# EAGLE design LightWand_KosmonautED (EAGLE 6.4)
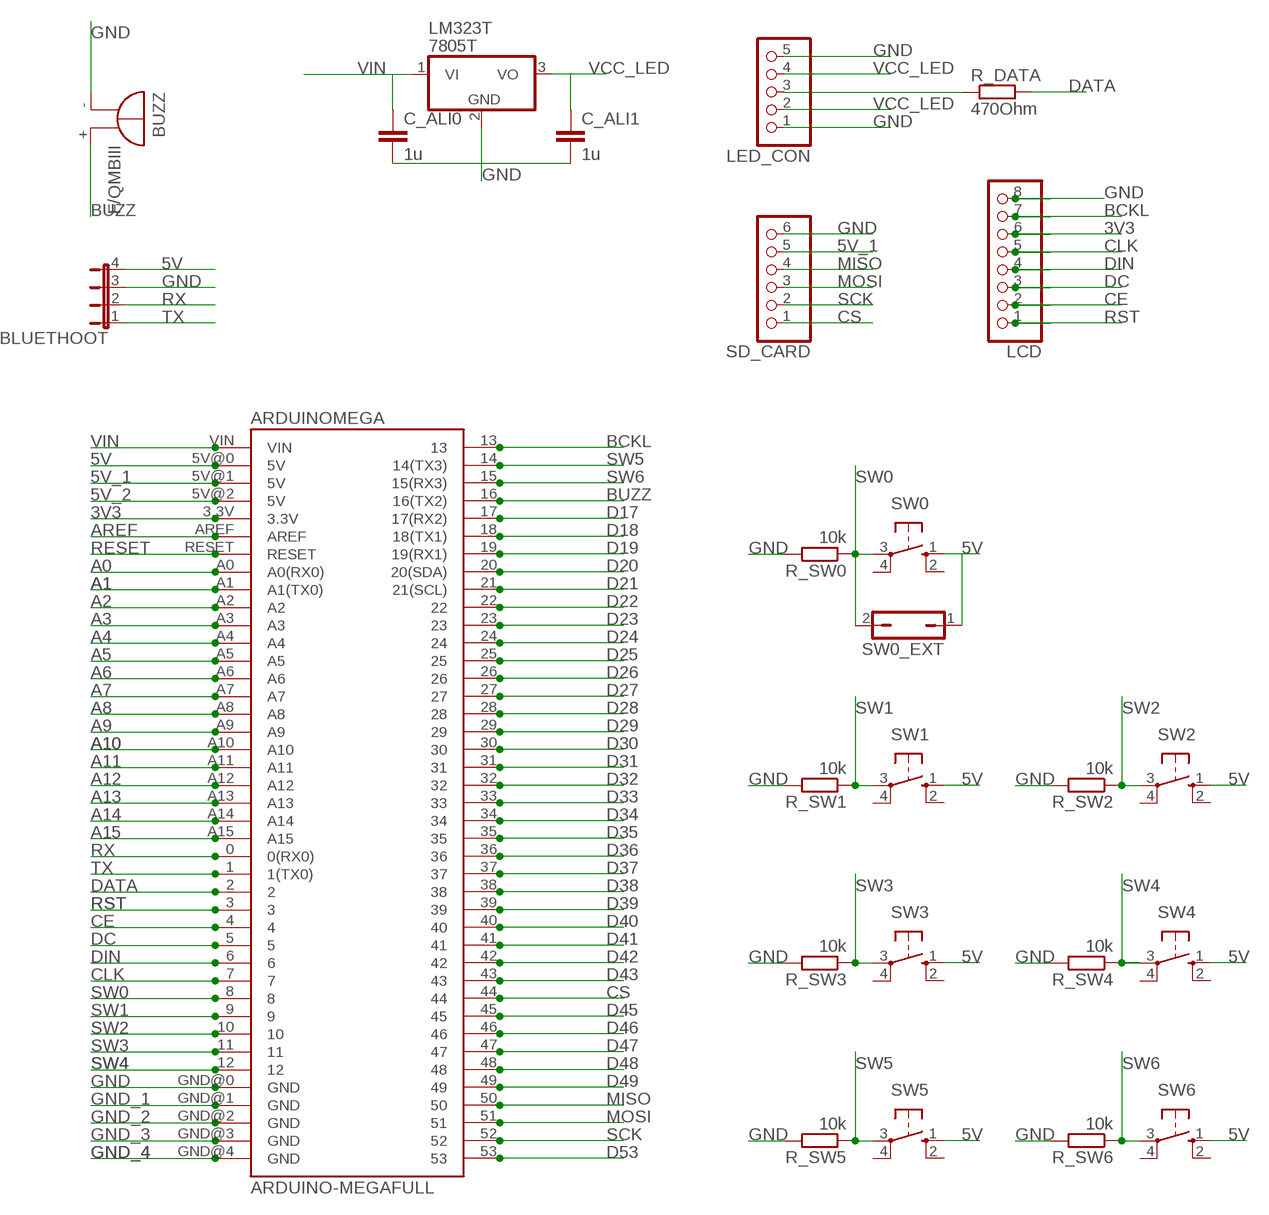
[diagram p0: schematic, sheet 1]

## Parts
ARDUINOMEGA  ARDUINO-MEGAFULL  [ARDUINO_MEGA]
BLUETHOOT  JP4E  [JP4]
BUZZ  F/QMBIII  [F/QMBIII]
C_ALI0  1u  C-EUC1206  [C1206]
C_ALI1  1u  C-EUC1206  [C1206]
LCD  PINHD-1X8  [1X08]
LED_CON  PINHD-1X5  [1X05]
LM323T  7805T  [TO220H]
R_DATA  470Ohm  R-EU_R1206  [R1206]
R_SW0  10k  R-EU_R1206  [R1206]
R_SW1  10k  R-EU_R1206  [R1206]
R_SW2  10k  R-EU_R1206  [R1206]
R_SW3  10k  R-EU_R1206  [R1206]
R_SW4  10k  R-EU_R1206  [R1206]
R_SW5  10k  R-EU_R1206  [R1206]
R_SW6  10k  R-EU_R1206  [R1206]
SD_CARD  PINHD-1X6  [1X06]
SW0  10-XX  [B3F-10XX]
SW0_EXT  JP1Q  [JP1]
SW1  10-XX  [B3F-10XX]
SW2  10-XX  [B3F-10XX]
SW3  10-XX  [B3F-10XX]
SW4  10-XX  [B3F-10XX]
SW5  10-XX  [B3F-10XX]
SW6  10-XX  [B3F-10XX]

## Nets
3V3: ARDUINOMEGA.3.3V LCD.6
5V: ARDUINOMEGA.5V@0(5V) BLUETHOOT.4 SW0.1(S) SW0_EXT.1 SW1.1(S) SW2.1(S) SW3.1(S) SW4.1(S) SW5.1(S) SW6.1(S)
5V_1: ARDUINOMEGA.5V@1(5V) SD_CARD.5
5V_2: ARDUINOMEGA.5V@2(5V)
A0: ARDUINOMEGA.A0(A0(RX0))
A1: ARDUINOMEGA.A1(A1(TX0))
A2: ARDUINOMEGA.A2
A3: ARDUINOMEGA.A3
A4: ARDUINOMEGA.A4
A5: ARDUINOMEGA.A5
A6: ARDUINOMEGA.A6
A7: ARDUINOMEGA.A7
A8: ARDUINOMEGA.A8
A9: ARDUINOMEGA.A9
A10: ARDUINOMEGA.A10
A11: ARDUINOMEGA.A11
A12: ARDUINOMEGA.A12
A13: ARDUINOMEGA.A13
A14: ARDUINOMEGA.A14
A15: ARDUINOMEGA.A15
AREF: ARDUINOMEGA.AREF
BCKL: ARDUINOMEGA.13 LCD.7
BUZZ: ARDUINOMEGA.16(16(TX2)) BUZZ.+(-)
CE: ARDUINOMEGA.4 LCD.2
CLK: ARDUINOMEGA.7 LCD.5
CS: ARDUINOMEGA.44 SD_CARD.1
D17: ARDUINOMEGA.17(17(RX2))
D18: ARDUINOMEGA.18(18(TX1))
D19: ARDUINOMEGA.19(19(RX1))
D20: ARDUINOMEGA.20(20(SDA))
D21: ARDUINOMEGA.21(21(SCL))
D22: ARDUINOMEGA.22
D23: ARDUINOMEGA.23
D24: ARDUINOMEGA.24
D25: ARDUINOMEGA.25
D26: ARDUINOMEGA.26
D27: ARDUINOMEGA.27
D28: ARDUINOMEGA.28
D29: ARDUINOMEGA.29
D30: ARDUINOMEGA.30
D31: ARDUINOMEGA.31
D32: ARDUINOMEGA.32
D33: ARDUINOMEGA.33
D34: ARDUINOMEGA.34
D35: ARDUINOMEGA.35
D36: ARDUINOMEGA.36
D37: ARDUINOMEGA.37
D38: ARDUINOMEGA.38
D39: ARDUINOMEGA.39
D40: ARDUINOMEGA.40
D41: ARDUINOMEGA.41
D42: ARDUINOMEGA.42
D43: ARDUINOMEGA.43
D45: ARDUINOMEGA.45
D46: ARDUINOMEGA.46
D47: ARDUINOMEGA.47
D48: ARDUINOMEGA.48
D49: ARDUINOMEGA.49
D53: ARDUINOMEGA.53
DATA: ARDUINOMEGA.2 R_DATA.2
DC: ARDUINOMEGA.5 LCD.3
DIN: ARDUINOMEGA.6 LCD.4
GND [GND]: ARDUINOMEGA.GND@0(GND) BLUETHOOT.3 BUZZ.-(+) C_ALI0.2 C_ALI1.2 LCD.8 LED_CON.1 LED_CON.5 LM323T.2(GND) R_SW0.2 R_SW1.2 R_SW2.2 R_SW3.2 R_SW4.2 R_SW5.2 R_SW6.2 SD_CARD.6
GND_1 [GND]: ARDUINOMEGA.GND@1(GND)
GND_2 [GND]: ARDUINOMEGA.GND@2(GND)
GND_3 [GND]: ARDUINOMEGA.GND@3(GND)
GND_4 [GND]: ARDUINOMEGA.GND@4(GND)
MISO: ARDUINOMEGA.50 SD_CARD.4
MOSI: ARDUINOMEGA.51 SD_CARD.3
N$3: LED_CON.3 R_DATA.1
RESET: ARDUINOMEGA.RESET
RST: ARDUINOMEGA.3 LCD.1
RX: ARDUINOMEGA.0(0(RX0)) BLUETHOOT.2
SCK: ARDUINOMEGA.52 SD_CARD.2
SW0: ARDUINOMEGA.8 R_SW0.1 SW0.3(P) SW0_EXT.2
SW1: ARDUINOMEGA.9 R_SW1.1 SW1.3(P)
SW2: ARDUINOMEGA.10 R_SW2.1 SW2.3(P)
SW3: ARDUINOMEGA.11 R_SW3.1 SW3.3(P)
SW4: ARDUINOMEGA.12 R_SW4.1 SW4.3(P)
SW5: ARDUINOMEGA.14(14(TX3)) R_SW5.1 SW5.3(P)
SW6: ARDUINOMEGA.15(15(RX3)) R_SW6.1 SW6.3(P)
TX: ARDUINOMEGA.1(1(TX0)) BLUETHOOT.1
VCC_LED [VCC]: C_ALI1.1 LED_CON.2 LED_CON.4 LM323T.3(VO)
VIN [VCC]: ARDUINOMEGA.VIN C_ALI0.1 LM323T.1(VI)
Unconnected: SW0.2(S1) SW0.4(P1) SW1.2(S1) SW1.4(P1) SW2.2(S1) SW2.4(P1) SW3.2(S1) SW3.4(P1) SW4.2(S1) SW4.4(P1) SW5.2(S1) SW5.4(P1) SW6.2(S1) SW6.4(P1)

## Library data of the parts
ARDUINOMEGA = SparkFun-Boards:ARDUINO-MEGA: Arduino Mega board footprint
BLUETHOOT = jumper:JP4E: JUMPER
BUZZ = buzzer:F/QMBIII: BUZZER Source: Buerklin; OC_FARNELL: unknown; OC_NEWARK: unknown
C_ALI0 C_ALI1 = resistor:C-EU: CAPACITOR, European symbol
LCD = pinhead:PINHD-1X8: PIN HEADER
LED_CON = pinhead:PINHD-1X5: PIN HEADER
LM323T = adafruit:78*: Positive VOLTAGE REGULATOR Added bigger pads to the TO-92 package
R_DATA R_SW0 R_SW1-R_SW6 = resistor:R-EU_: RESISTOR, European symbol
SD_CARD = pinhead:PINHD-1X6: PIN HEADER
SW0 SW1-SW6 = switch-omron:10-XX: OMRON SWITCH; MPN: B3F-1000; OC_FARNELL: 176432; OC_NEWARK: 36M3542
SW0_EXT = jumper:JP1Q: JUMPER

## Net classes
1 GND: width 1.016 mm
2 VCC: width 0.889 mm

## Board
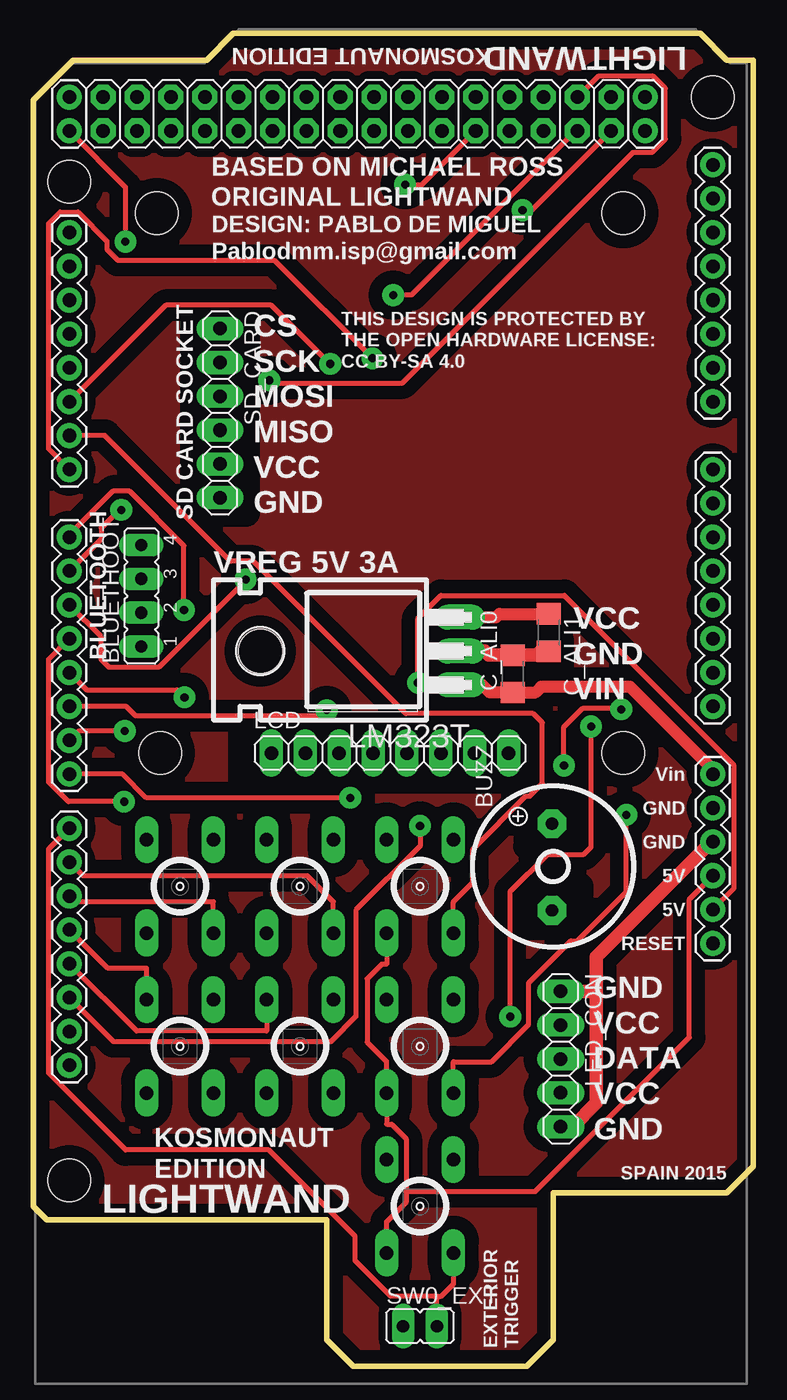
[diagram p1: board, top side]
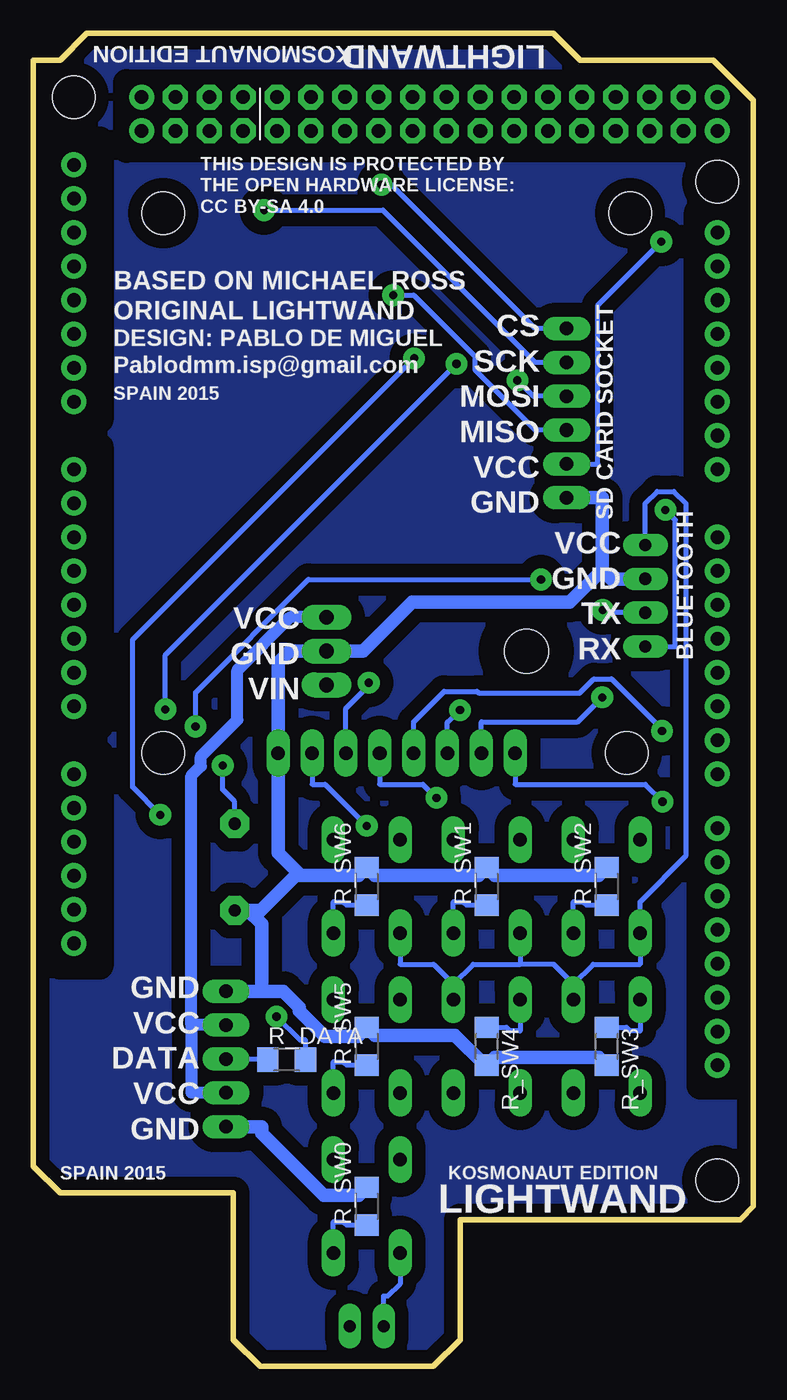
[diagram p2: board, bottom side, seen from below]

Size 54 x 100 mm. Coordinates in mm from the lower left corner, seen from the top.
Outline: 1,11 21,11 22,11 22,2 24,0 37,0 39,2 39,13 52,13 54,15 54,98 52,98 50,100 15,100 13,98 3,98 0,95 0,12 1,11
Copper layers (1*16): Top 0.035mm / dielectric 1.5mm / Bottom 0.035mm
Design rules "default *": minimum track width 15mil, minimum drill 24mil, track to track 15mil, track to pad 15mil, pad to pad 15mil, via to via 15mil, smd to smd 8mil, copper to edge 40mil, drill to drill 8mil, minimum pad ring 15mil, minimum via ring 20mil, stop-mask expansion 4mil, vias tented up to drill 0mil, thermal gap 10mil
Holes 3.2 mm at 9.5,46 44.25,46 9.25,86.5 44.25,86.5
tRestrict: area 15.6,44 to 37.6,48; area 12,64 to 16,79; area 6,53 to 9,63; area 37,39 to 40,42; area 37,33 to 40,35; area 37,33 to 41,36; area 37,39 to 41,42
bRestrict: area 1,21 to 4,42; area 1,43 to 4,64; area 1.2,65.6 to 4.2,86.6; area 1,91.3 to 47,96.3; area 49,71 to 53,92; area 49,48 to 53,69; area 49,30 to 52,46
vRestrict: area 33.8,58 to 47.9,72.1; area 20,83.7 to 29.8,87.3; area 4.6,13.9 to 8.5,19.5; area 23.8,64.2 to 30.4,74.2; area 29.4,66.5 to 33,70.8; area 21,64.7 to 24.1,70.5; area 24.7,57.6 to 32,64.9

### Footprints (pad centres in the part's own frame; a part is rotated, then mirrored left to right if it is on the bottom)
ARDUINO_MEGA = drill 1.016 pad 1.88: 0 63.5,50.8; 1 60.96,50.8; 2 58.42,50.8; 3 55.88,50.8; 3.3V 35.56,2.54; 4 53.34,50.8; 5 50.8,50.8; 5V@0 38.1,2.54; 5V@1 93.98,50.8; 5V@2 96.52,50.8; 6 48.26,50.8; 7 45.72,50.8; 8 41.656,50.8; 9 39.116,50.8; 10 36.576,50.8; 11 34.036,50.8; 12 31.496,50.8; 13 28.956,50.8; 14 68.58,50.8; 15 71.12,50.8; 16 73.66,50.8; 17 76.2,50.8; 18 78.74,50.8; 19 81.28,50.8; 20 83.82,50.8; 21 86.36,50.8; A0 50.8,2.54; A1 53.34,2.54; A2 55.88,2.54; A3 58.42,2.54; A4 60.96,2.54; A5 63.5,2.54; A6 66.04,2.54; A7 68.58,2.54; A8 73.66,2.54; A9 76.2,2.54; A10 78.74,2.54; A11 81.28,2.54; A12 83.82,2.54; A13 86.36,2.54; A14 88.9,2.54; A15 91.44,2.54; AREF 23.876,50.8; GND@0 40.64,2.54; GND@1 43.18,2.54; GND@2 93.98,7.62; GND@3 96.52,7.62; GND@4 26.416,50.8; RESET 33.02,2.54; VIN 45.72,2.54 | drill 1.016 pad 1.88 octagon: 22 93.98,48.26; 23 96.52,48.26; 24 93.98,45.72; 25 96.52,45.72; 26 93.98,43.18; 27 96.52,43.18; 28 93.98,40.64; 29 96.52,40.64; 30 93.98,38.1; 31 96.52,38.1; 32 93.98,35.56; 33 96.52,35.56; 34 93.98,33.02; 35 96.52,33.02; 36 93.98,30.48; 37 96.52,30.48; 38 93.98,27.94; 39 96.52,27.94; 40 93.98,25.4; 41 96.52,25.4; 42 93.98,22.86; 43 96.52,22.86; 44 93.98,20.32; 45 96.52,20.32; 46 93.98,17.78; 47 96.52,17.78; 48 93.98,15.24; 49 96.52,15.24; 50 93.98,12.7; 51 96.52,12.7; 52 93.98,10.16; 53 96.52,10.16 | hole 3.2: 15.24,50.8; 90.17,50.8; 96.52,2.54
JP4 = drill 0.914 long: 1 -3.81,0; 2 -1.27,0; 3 1.27,0; 4 3.81,0
F/QMBIII = drill 0.914 pad 2.159 octagon: + 3.251,0; - -3.251,0
C1206 = smd 1.6 x 1.8: 1 -1.4,0; 2 1.4,0
1X08 = drill 1.016 long: 1 -8.89,0; 2 -6.35,0; 3 -3.81,0; 4 -1.27,0; 5 1.27,0; 6 3.81,0; 7 6.35,0; 8 8.89,0
1X05 = drill 1.016 long: 1 -5.08,0; 2 -2.54,0; 3 0,0; 4 2.54,0; 5 5.08,0
TO220H = drill 1.118 long: 1 -2.54,-10.16; 2 0,-10.16; 3 2.54,-10.16 | hole 3.302: 0,4.826
R1206 = smd 1.6 x 1.803: 1 -1.422,0; 2 1.422,0
1X06 = drill 1.016 long: 1 -6.35,0; 2 -3.81,0; 3 -1.27,0; 4 1.27,0; 5 3.81,0; 6 6.35,0
B3F-10XX = drill 1.016 long: 1 -3.5,2.5; 2 3.5,2.5; 3 -3.5,-2.5; 4 3.5,-2.5
JP1 = drill 0.914 long: 1 0,-1.27; 2 0,1.27

### Placement (x,y rotation side)
ARDUINOMEGA  53.5,-1.3 90 top
BLUETHOOT  8.1,57.8 90 top
BUZZ  38.9,37.45 90 top
C_ALI0  35.95,51.95 90 top
C_ALI1  38.65,55.05 270 top
LCD  26.75,46 0 top
LED_CON  39.55,23.05 270 top
LM323T  21.85,53.65 90 top
R_DATA  35,23 0 bottom
R_SW0  29,12 90 bottom
R_SW1  20,36 90 bottom
R_SW2  11,36 90 bottom
R_SW3  11,24 270 bottom
R_SW4  20,24 270 bottom
R_SW5  29,24 90 bottom
R_SW6  29,36 90 bottom
SD_CARD  14,71.5 270 top
SW0  29,12 90 top
SW0_EXT  29,3 270 top
SW1  20,36 90 top
SW2  11,36 90 top
SW3  11,24 270 top
SW4  20,24 270 top
SW5  29,24 90 top
SW6  29,36 90 top

### Tracks (layer width: path | path; a pad name or v marks a point on that pad's centre or on a via)
3V3  (via drill 0.61 pad 1.63)
  Top 0.381: v28.84,51.27 28.84,56.11 30.56,57.82 39.82,57.82 52.52,45.12 52.52,35.83 ARDUINOMEGA.3.3V
  Bottom 0.381: LCD.6 30.56,49.36 28.84,51.08 v28.84,51.27
5V
  Top 0.381: SW6.1 26.5,30.15 26.12,30.15 25.04,29.07 25.04,24.31 26.5,22.85 SW5.1 26.5,18.15 26.88,18.15 27.96,17.07 27.96,13.12 | 27.96,13.12 27.96,12.31 26.5,10.85 SW0.1 | 27.96,13.12 37.65,13.12 49.2,24.66 49.2,35.03 ARDUINOMEGA.5V@0
  Bottom 0.381: BLUETHOOT.4 8.1,64.76 7.22,65.64 5.96,65.64 5.06,64.74 5.06,38.29 8.5,34.85 SW2.1 8.5,30.15 12.02,30.15 13.5,28.68 | SW0_EXT.1 27.73,5.25 27.4,5.25 26.5,6.15 SW0.1 | 22.5,28.68 23.98,30.15 26.5,30.15 SW6.1 | 22.5,28.68 21.02,30.15 17.5,30.15 | 13.5,28.68 14.98,30.15 17.5,30.15 | SW1.1 17.5,30.15 | SW4.1 22.5,28.68 | SW3.1 13.5,28.68
5V_1  (via drill 0.61 pad 1.63)
  Top 0.381: ARDUINOMEGA.5V@1 6.91,88.47 v6.91,84.36
  Bottom 0.381: SD_CARD.5 11.65,67.69 11.65,79.62 v6.91,84.36
BCKL  (via drill 0.61 pad 1.63)
  Top 0.381: v29,40.54 29,39.03 24.2,34.23 24.2,26.23 22.31,24.34 6.02,24.34 ARDUINOMEGA.13
  Bottom 0.381: LCD.7 33.1,43.65 32.11,43.65 v29,40.54
BUZZ  (via drill 0.61 pad 1.63)
  Top 0.381: v22.27,75.2 17.86,79.61 9.95,79.61 ARDUINOMEGA.16 | v39.8,45.07 39.8,47.96 41.21,49.37 44,49.37 v44.09,49.28
  Bottom 0.381: BUZZ.+ 38.9,42.35 39.8,43.25 v39.8,45.07 | v44.09,49.28 44.09,53.37 v22.27,75.2
CE  (via drill 0.61 pad 1.63)
  Top 0.381: ARDUINOMEGA.4 4,50.74 10.77,50.74 | 10.77,50.74 | 10.77,50.74 v11.34,50.18
  Bottom 0.381: LCD.2 20.4,48.35 13.16,48.35 v11.34,50.18
CLK  (via drill 0.61 pad 1.63)
  Top 0.381: v23.76,42.64 8.48,42.64 6.7,44.42 ARDUINOMEGA.7
  Bottom 0.381: LCD.5 28.02,43.65 24.78,43.65 v23.76,42.64
CS  (via drill 0.61 pad 1.63)
  Top 0.381: v27.89,88.64 29.14,88.64 ARDUINOMEGA.44
  Bottom 0.381: SD_CARD.1 16.35,77.85 27.14,88.64 v27.89,88.64
DATA  (via drill 0.61 pad 1.63)
  Top 0.381: v15.92,59.02 15.92,58.95 9.4,52.43 5.68,52.43 5.09,53.02 5.09,54.73 ARDUINOMEGA.2 | v35.77,26.22 35.77,35.61 38.56,38.41 41.29,38.41 41.84,38.95 v41.84,47.99
  Bottom 0.381: R_DATA.2 33.58,24.47 34.02,24.47 v35.77,26.22 | v41.84,47.99 41.84,50.55 33.37,59.02 v15.92,59.02
DC  (via drill 0.61 pad 1.63)
  Top 0.381: v22,49.22 21.58,48.79 7.67,48.79 6.96,49.5 ARDUINOMEGA.5
  Bottom 0.381: LCD.3 22.94,48.35 22.87,48.35 v22,49.22
DIN  (via drill 0.61 pad 1.63)
  Top 0.381: v6.85,47.65 3.39,47.65 ARDUINOMEGA.6
  Bottom 0.381: LCD.4 25.48,48.35 23.2,50.63 20.71,50.63 20.58,50.5 13.02,50.5 11.96,51.56 10.63,51.56 6.85,47.79 v6.85,47.65
GND
  Top 1.016: LM323T.2 33.86,53.65 34.16,53.35 C_ALI0.2 37.74,53.35 38.04,53.65 C_ALI1.2 | 42.22,28.13 42.22,30.7 50.86,39.34 ARDUINOMEGA.GND@0 | LED_CON.5 40.45,17.97 42.22,19.74 42.22,28.13 | LED_CON.1 42.22,28.13
  Bottom 1.016: 11.33,59.74 13.75,57.32 25.57,57.32 29.24,53.65 LM323T.2 34.78,53.65 35.64,52.79 LCD.8 35.64,38.5 34.14,36.99 | 36.88,28.13 35.27,28.13 34.06,26.93 34.06,26.66 32.16,24.75 29.67,24.75 R_SW5.2 28.41,24.83 22.38,24.83 20.12,22.58 R_SW4.2 19.4,23.18 11.6,23.18 R_SW3.2 | R_SW0.2 29.6,12.82 32.24,12.82 36.88,17.47 36.88,17.97 LED_CON.5 | 34.14,36.99 33.98,36.83 29.59,36.83 R_SW6.2 28.41,36.83 20.59,36.83 R_SW1.2 19.41,36.83 11.59,36.83 R_SW2.2 | LED_CON.1 36.88,28.13 | 37.92,34.2 36.88,33.17 36.88,28.13 | 37.92,34.2 36.93,34.2 34.14,36.99 | BUZZ.- 37.92,34.2 | 11.33,59.74 10.66,59.07 BLUETHOOT.3 | 11.33,59.74 11.33,65.15 SD_CARD.6
MISO  (via drill 0.61 pad 1.63)
  Top 0.381: ARDUINOMEGA.50 40.68,92.68 28.36,80.36 v27,80.36
  Bottom 0.381: v27,80.36 25.47,80.36 20.88,75.77 20.88,74.76 16.35,70.23 SD_CARD.4
MOSI  (via drill 0.61 pad 1.63)
  Top 0.381: v17.69,73.97 17.89,73.77 27.69,73.77 44.99,91.07 46.42,91.07 47.41,92.06 47.41,95.87 46.5,96.78 42.36,96.78 ARDUINOMEGA.51
  Bottom 0.381: SD_CARD.3 16.5,72.77 v17.69,73.97
N$1
  pour Top (isolate 1.016): 1,11 22,11 22,2 24,0 37,0 39,2 39,13 52,13 54,15 54,98 52,98 50,100 15,100 13,98 3,98 0,95 0,12
N$2
  pour Bottom (isolate 1.016): 0,12 1,11 22,11 22,2 24,0 37,0 39,2 39,13 52,13 54,15 54,98 52,98 50,100 15,100 13,98 3,98 0,95
N$3
  Bottom 0.381: LED_CON.3 37.2,23.05 37.15,23 R_DATA.1
RST  (via drill 0.61 pad 1.63)
  Top 0.381: v6.81,42.35 2.62,42.35 1.14,43.83 1.14,53.02 ARDUINOMEGA.3
  Bottom 0.381: LCD.1 17.86,43.65 8.11,43.65 v6.81,42.35
RX  (via drill 0.61 pad 1.63)
  Top 0.381: v11.3,56.73 11.3,61.56 7.22,65.64 5.96,65.64 2.7,62.38 ARDUINOMEGA.0
  Bottom 0.381: BLUETHOOT.2 11.1,56.53 v11.3,56.73
SCK  (via drill 0.61 pad 1.63)
  Top 0.381: v36.69,86.74 37.4,86.74 ARDUINOMEGA.52
  Bottom 0.381: SD_CARD.2 16.35,75.31 27.78,86.74 v36.69,86.74
SW0
  Top 0.381: 30.27,5.25 26.79,5.25 24.13,7.91 24.13,9.75 17.66,16.21 6.92,16.21 1.14,21.99 1.14,38.8 ARDUINOMEGA.8 | 30.27,5.25 30.27,5.06 SW0_EXT.2 | 30.27,5.25 30.6,5.25 31.5,6.15 SW0.3
  Bottom 0.381: R_SW0.1 30.47,10.58 30.75,10.85 31.5,10.85 SW0.3
SW1
  Top 0.381: SW1.3 22.5,34.85 20.56,36.79 3.73,36.79 ARDUINOMEGA.9
  Bottom 0.381: R_SW1.1 21.47,34.58 21.75,34.85 22.5,34.85 SW1.3
SW2
  Top 0.381: SW2.3 13.5,34.85 3.13,34.85 ARDUINOMEGA.10
  Bottom 0.381: R_SW2.1 12.47,34.58 12.74,34.85 13.5,34.85 SW2.3
SW3
  Top 0.381: SW3.3 8.5,29.85 5.59,29.85 ARDUINOMEGA.11
  Bottom 0.381: R_SW3.1 9.53,25.42 9.26,25.15 8.5,25.15 SW3.3
SW4
  Top 0.381: ARDUINOMEGA.12 7.75,25.15 17.5,25.15 SW4.3
  Bottom 0.381: R_SW4.1 18.53,25.42 18.25,25.15 17.5,25.15 SW4.3
SW5  (via drill 0.61 pad 1.63)
  Top 0.381: ARDUINOMEGA.14 1.14,68.84 1.14,85.72 2,86.58 3.36,86.58 5.52,84.42 5.52,83.79 6.33,82.98 18.08,82.98 v25.44,75.62 | v44.48,41.37 44.48,35.58 40.81,31.91 40.31,31.91 37.15,28.74 37.15,25.64 34.36,22.85 31.5,22.85 SW5.3
  Bottom 0.381: v44.48,41.37 46.55,43.44 46.55,54.51 v25.44,75.62 | R_SW5.1 30.47,22.58 30.75,22.85 31.5,22.85 SW5.3
SW6
  Top 0.381: ARDUINOMEGA.15 5.36,69.82 14.78,60.4 16.5,60.4 27.94,48.96 37.49,48.96 38.17,48.28 38.17,43.71 37.23,42.77 36.95,42.77 32.96,38.78 32.96,36.31 31.5,34.85 SW6.3
  Bottom 0.381: R_SW6.1 30.47,34.58 30.75,34.85 31.5,34.85 SW6.3
TX  (via drill 0.61 pad 1.63)
  Top 0.381: v6.6,64.25 6.44,64.25 5.09,62.9 5.09,62.05 ARDUINOMEGA.1
  Bottom 0.381: BLUETHOOT.1 5.85,53.99 5.85,63.49 v6.6,64.25
VCC_LED
  Top 0.889: LM323T.3 34.72,56.19 34.98,56.45 C_ALI1.1
  Bottom 0.889: 42.15,25.59 42.15,44.31 41.44,45.03 41.44,45.75 38.7,48.49 38.7,52.21 34.72,56.19 LM323T.3 | LED_CON.4 42.15,20.51 42.15,25.59 | LED_CON.2 42.15,25.59
VIN
  Top 0.889: ARDUINOMEGA.VIN 50.96,44.75 44.75,50.96 38.09,50.96 37.68,50.55 C_ALI0.1 34.22,50.55 33.66,51.11 LM323T.1

### Text on the board
_tsilk: KOSMONAUT EDITION | LIGHTWAND | BASED ON MICHAEL ROSS / ORIGINAL LIGHTWAND | DESIGN: PABLO DE MIGUEL / Pablodmm.isp@gmail.com | THIS DESIGN IS PROTECTED BY / THE OPEN HARDWARE LICENSE: / CC BY-SA 4.0 | SD CARD SOCKET | CS / SCK / MOSI / MISO / VCC / GND | CS / SCK / MOSI / MISO / VCC / GND | VREG 5V 3A | BLUETOOTH | VCC / GND / VIN | VCC / GND / VIN | GND / VCC / DATA / VCC / GND | KOSMONAUT / EDITION | SPAIN 2015 | LIGHTWAND | EXTERIOR / TRIGGER
_bsilk: LIGHTWAND | KOSMONAUT EDITION | THIS DESIGN IS PROTECTED BY / THE OPEN HARDWARE LICENSE: / CC BY-SA 4.0 | BASED ON MICHAEL ROSS / ORIGINAL LIGHTWAND | DESIGN: PABLO DE MIGUEL / Pablodmm.isp@gmail.com | SPAIN 2015 | SD CARD SOCKET | CS / SCK / MOSI / MISO / VCC / GND | BLUETOOTH | VCC / GND / TX / RX | VCC / GND / VIN | GND / VCC / DATA / VCC / GND | KOSMONAUT EDITION | SPAIN 2015 | LIGHTWAND